# Altium schematic sheet Zero Crossing.SchDoc
size 114 x 50 mm; PageSetup: Record=PageOptions|CenterHorizontal=True|CenterVertical=True|PrintScale=0.71|XCorrection=1.00|YCorrection=1.00|PrintKind=1|BorderSize=5000000|LeftOffset=0|BottomOffset=0|Orientation=2|PaperLength=1000|PaperWidth=1000|Scale=100|PaperSource=15|PrintQuality=4000|MediaType=1|DitherType=10|PrintScaleMode=1|PaperKind=A4|PaperIndex=9
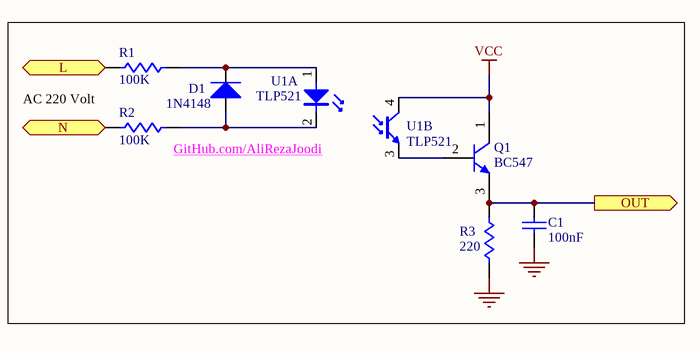
[diagram p0: Zero Crossing.SchDoc]

## Parts
C1  100nF  [CAPNTO5.08-7.37x3.94]
D1  1N4148  [DIODE0.2_]
Q1  BC547  [TO92C]
R1  100K  [AXIAL-0.4]
R2  100K  [AXIAL-0.4]
R3  220  [AXIAL-0.4]
U1  TLP521  [DIP-4]  (parts A,B of 2)

## Ports
L (in), N (in), OUT (out)

## Nets
GND: C1.1 R3.2
VCC: Q1.1(C) U1.4(C)
L: R1.1 ; port L
N: R2.1 ; port N
OUT: C1.2 Q1.3(E) R3.1 ; port OUT
NetD1_1: D1.1(A) R2.2 U1.2(K)
NetD1_2: D1.2(K) R1.2 U1.1(A)
NetQ1_2: Q1.2(B) U1.3(E)

## Notes on the sheet
- AC 220 Volt
- (near R2) GitHub.com/AliRezaJoodi

## Library data of the parts
C1 = Cap: Capacitor; Manufacturer: Generic Components; Class I: Passive; Published: 8-Jun-2000; Revision: July-2002: Re-released for DXP Platform.; Publisher: Altium Limited; Class II: Capacitor
D1 = Diode: Default Diode; Manufacturer: Generic Components; Class I: Discrete; Class II: Diode - Switching; Published: 8-Jun-2000; Revision: July-2002: Re-released for DXP Platform.; Publisher: Altium Limited
Q1 = NPN: Silicon Bipolar Transistor; Package Reference: TO-92A
R1-R3 = Res1: Resistor; Manufacturer: Generic Components; Class I: Passive; Published: 8-Jun-2000; Revision: July-2002: Re-released for DXP Platform.; Publisher: Altium Limited; Class II: Resistor
U1 = Optoisolator: Publisher: Altium Limited